# EAGLE design power (EAGLE 5.07)
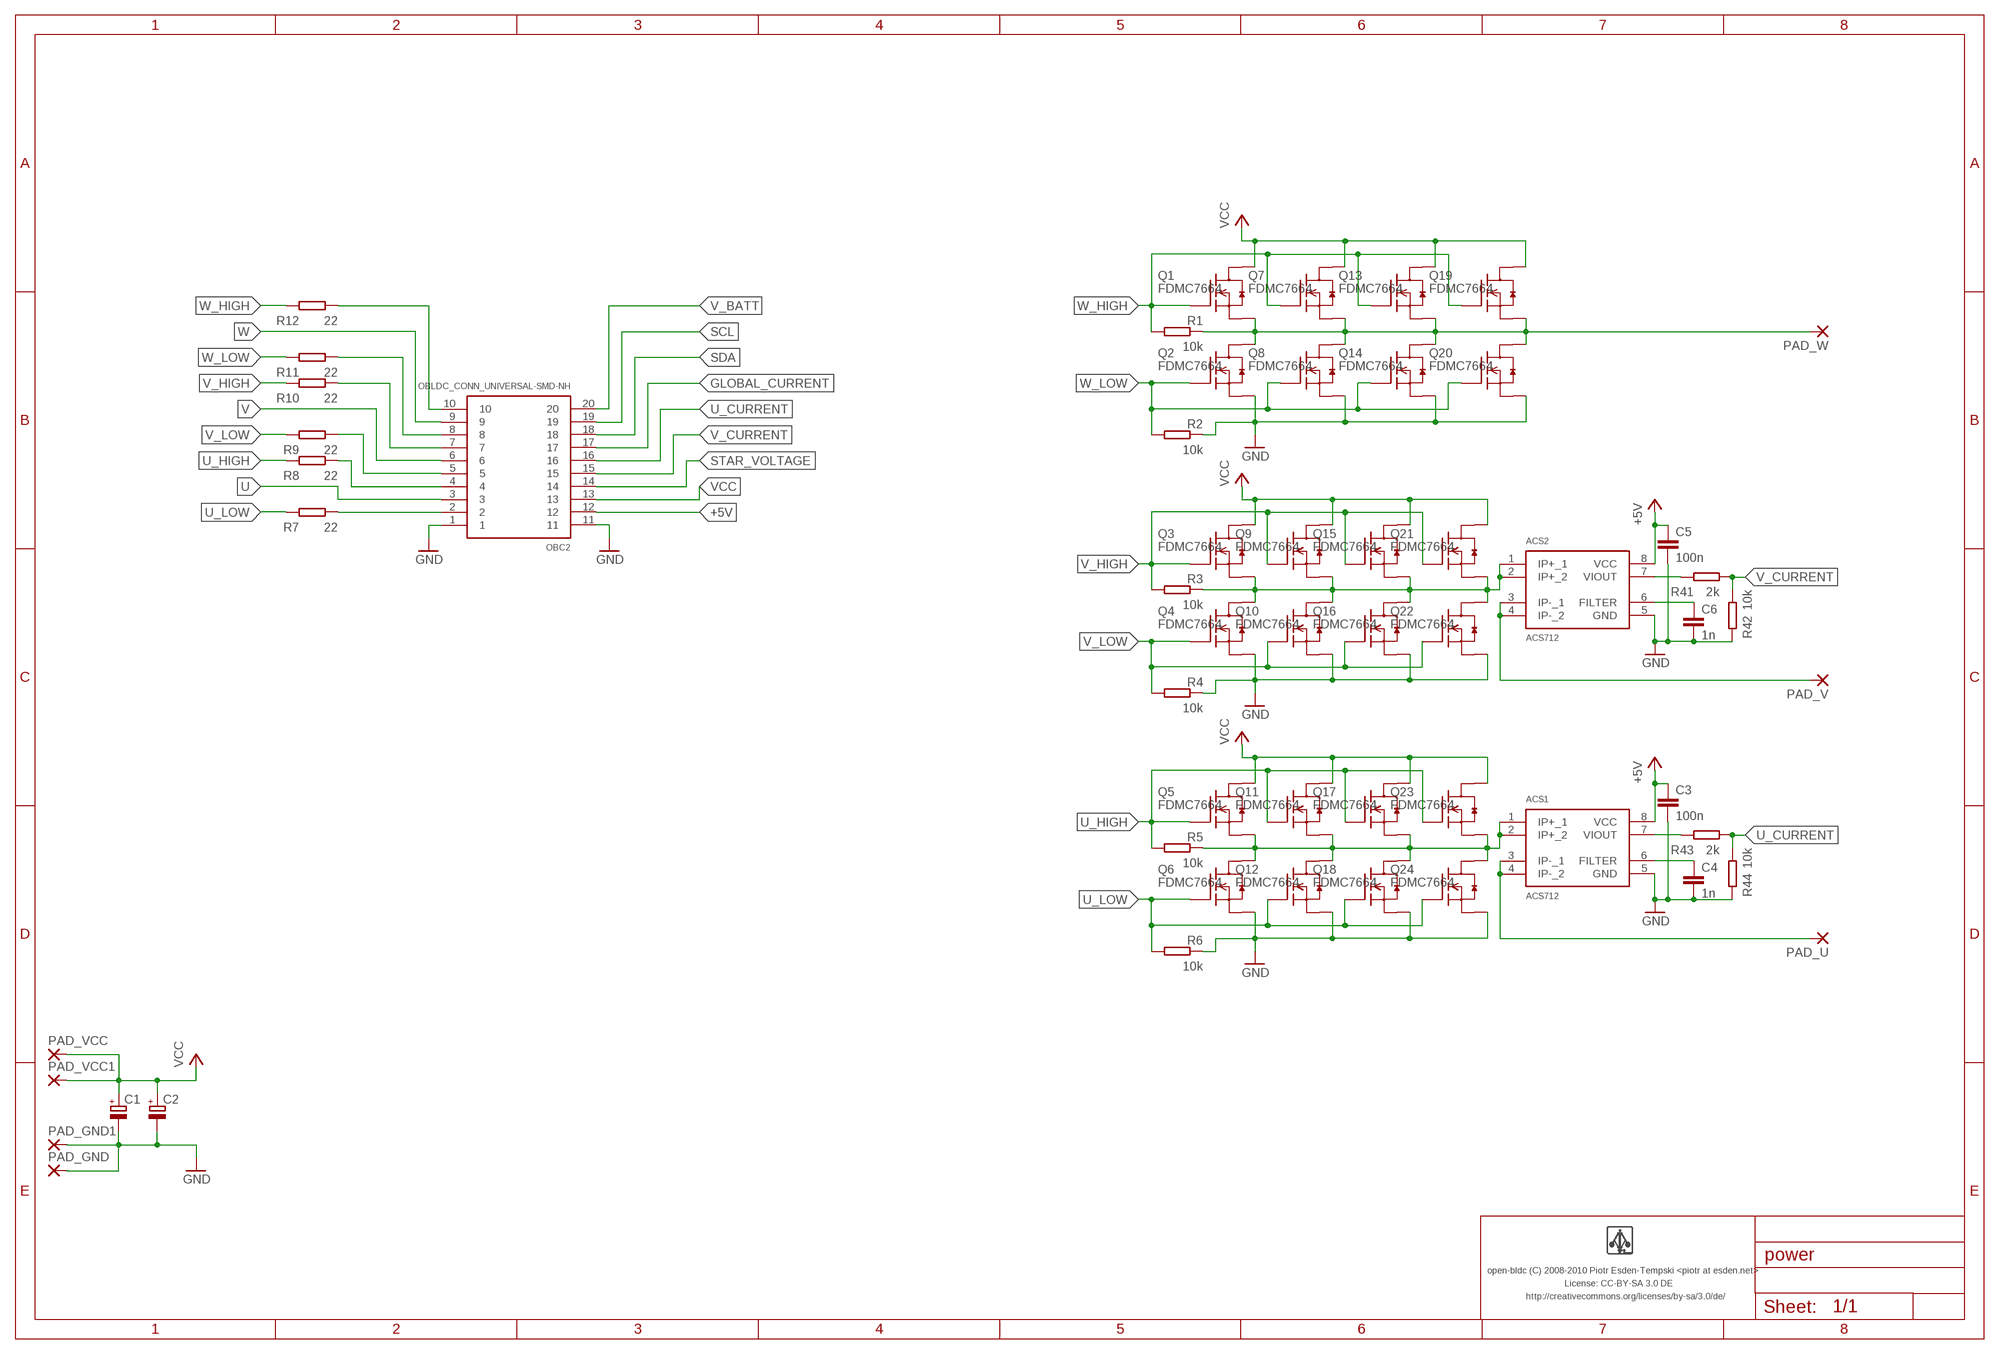
[diagram p0: schematic, sheet 1]

## Parts
ACS1  ACS712  [SO8]
ACS2  ACS712  [SO8]
C1  CPOL-EUE5-10.5  [E5-10,5]
C2  CPOL-EUE5-10.5  [E5-10,5]
C3  100n  CAPACITOR-0603  [0603-CAP]
C4  1n  CAPACITOR-0603  [0603-CAP]
C5  100n  CAPACITOR-0603  [0603-CAP]
C6  1n  CAPACITOR-0603  [0603-CAP]
OBC2  OBLDC_CONN_UNIVERSAL-SMD-NH  [OBLDC_CONN_SMD_NO_HOLES]
PAD_GND  WIREPAD-2MM  [WIREPAD_2MM]
PAD_GND1  WIREPAD-2MM  [WIREPAD_2MM]
PAD_U  WIREPAD-2MM  [WIREPAD_2MM]
PAD_V  WIREPAD-2MM  [WIREPAD_2MM]
PAD_VCC  WIREPAD-2MM  [WIREPAD_2MM]
PAD_VCC1  WIREPAD-2MM  [WIREPAD_2MM]
PAD_W  WIREPAD-2MM  [WIREPAD_2MM]
Q1  FDMC7664  [MLP33]
Q2  FDMC7664  [MLP33]
Q3  FDMC7664  [MLP33]
Q4  FDMC7664  [MLP33]
Q5  FDMC7664  [MLP33]
Q6  FDMC7664  [MLP33]
Q7  FDMC7664  [MLP33]
Q8  FDMC7664  [MLP33]
Q9  FDMC7664  [MLP33]
Q10  FDMC7664  [MLP33]
Q11  FDMC7664  [MLP33]
Q12  FDMC7664  [MLP33]
Q13  FDMC7664  [MLP33]
Q14  FDMC7664  [MLP33]
Q15  FDMC7664  [MLP33]
Q16  FDMC7664  [MLP33]
Q17  FDMC7664  [MLP33]
Q18  FDMC7664  [MLP33]
Q19  FDMC7664  [MLP33]
Q20  FDMC7664  [MLP33]
Q21  FDMC7664  [MLP33]
Q22  FDMC7664  [MLP33]
Q23  FDMC7664  [MLP33]
Q24  FDMC7664  [MLP33]
R1  10k  RESISTOR-0603  [0603-RES]
R2  10k  RESISTOR-0603  [0603-RES]
R3  10k  RESISTOR-0603  [0603-RES]
R4  10k  RESISTOR-0603  [0603-RES]
R5  10k  RESISTOR-0603  [0603-RES]
R6  10k  RESISTOR-0603  [0603-RES]
R7  22  RESISTOR-0603  [0603-RES]
R8  22  RESISTOR-0603  [0603-RES]
R9  22  RESISTOR-0603  [0603-RES]
R10  22  RESISTOR-0603  [0603-RES]
R11  22  RESISTOR-0603  [0603-RES]
R12  22  RESISTOR-0603  [0603-RES]
R41  2k  RESISTOR-0603  [0603-RES]
R42  10k  RESISTOR-0603  [0603-RES]
R43  2k  RESISTOR-0603  [0603-RES]
R44  10k  RESISTOR-0603  [0603-RES]
U$2  LOGO-NORM  [LOGO]

## Nets
+5V: ACS1.8(VCC) ACS2.8(VCC) C3.P$1 C5.P$1 OBC2.12
GLOBAL_CURRENT: OBC2.17
GND: ACS1.5(GND) ACS2.5(GND) C1.- C2.- C3.P$2 C4.P$2 C5.P$2 C6.P$2 OBC2.1 OBC2.11 PAD_GND1.1(P) PAD_GND.1(P) Q2.123S(S) Q4.123S(S) Q6.123S(S) Q8.123S(S) Q10.123S(S) Q12.123S(S) Q14.123S(S) Q16.123S(S) Q18.123S(S) Q20.123S(S) Q22.123S(S) Q24.123S(S) R2.P$1 R4.P$1 R6.P$1 R42.P$2 R44.P$2
N$1: ACS1.3(IP-_1) ACS1.4(IP-_2) PAD_U.1(P)
N$2: ACS2.6(FILTER) C6.P$1
N$3: ACS2.3(IP-_1) ACS2.4(IP-_2) PAD_V.1(P)
N$4: OBC2.2 R7.P$1
N$5: OBC2.4 R8.P$1
N$6: OBC2.5 R9.P$1
N$7: OBC2.7 R10.P$1
N$8: OBC2.8 R11.P$1
N$9: OBC2.10 R12.P$1
N$31: ACS1.6(FILTER) C4.P$1
N$32: ACS2.7(VIOUT) R41.P$2
N$35: ACS1.7(VIOUT) R43.P$2
SCL: OBC2.19
SDA: OBC2.18
STAR_VOLTAGE: OBC2.14
U: ACS1.1(IP+_1) ACS1.2(IP+_2) OBC2.3 Q5.123S(S) Q6.5678D(D) Q11.123S(S) Q12.5678D(D) Q17.123S(S) Q18.5678D(D) Q23.123S(S) Q24.5678D(D) R5.P$1
U_CURRENT: OBC2.16 R43.P$1 R44.P$1
U_HIGH: Q5.4G(G) Q11.4G(G) Q17.4G(G) Q23.4G(G) R5.P$2 R8.P$2
U_LOW: Q6.4G(G) Q12.4G(G) Q18.4G(G) Q24.4G(G) R6.P$2 R7.P$2
V: ACS2.1(IP+_1) ACS2.2(IP+_2) OBC2.6 Q3.123S(S) Q4.5678D(D) Q9.123S(S) Q10.5678D(D) Q15.123S(S) Q16.5678D(D) Q21.123S(S) Q22.5678D(D) R3.P$1
V_BATT: OBC2.20
V_CURRENT: OBC2.15 R41.P$1 R42.P$1
V_HIGH: Q3.4G(G) Q9.4G(G) Q15.4G(G) Q21.4G(G) R3.P$2 R10.P$2
V_LOW: Q4.4G(G) Q10.4G(G) Q16.4G(G) Q22.4G(G) R4.P$2 R9.P$2
VCC: C1.+ C2.+ OBC2.13 PAD_VCC1.1(P) PAD_VCC.1(P) Q1.5678D(D) Q3.5678D(D) Q5.5678D(D) Q7.5678D(D) Q9.5678D(D) Q11.5678D(D) Q13.5678D(D) Q15.5678D(D) Q17.5678D(D) Q19.5678D(D) Q21.5678D(D) Q23.5678D(D)
W: OBC2.9 PAD_W.1(P) Q1.123S(S) Q2.5678D(D) Q7.123S(S) Q8.5678D(D) Q13.123S(S) Q14.5678D(D) Q19.123S(S) Q20.5678D(D) R1.P$1
W_HIGH: Q1.4G(G) Q7.4G(G) Q13.4G(G) Q19.4G(G) R1.P$2 R12.P$2
W_LOW: Q2.4G(G) Q8.4G(G) Q14.4G(G) Q20.4G(G) R2.P$2 R11.P$2

## Notes on the sheet
- open-bldc (C) 2008-2010 Piotr Esden-Tempski <piotr at esden.net>
- License: CC-BY-SA 3.0 DE
- http://creativecommons.org/licenses/by-sa/3.0/de/

## Library data of the parts
ACS1 ACS2 = open-bldc:ACS712
C1 C2 = resistor:CPOL-EU: POLARIZED CAPACITOR, European symbol
C3-C6 = pel_dipol_comp:CAPACITOR
OBC2 = open-bldc:OBLDC_CONN_UNIVERSAL
PAD_GND PAD_GND1 PAD_U PAD_V PAD_VCC PAD_VCC1 PAD_W = open-bldc:WIREPAD: THROUGH-HOLE PAD
Q1-Q24 = open-bldc:FDMC7664
R1-R12 R41-R44 = pel_dipol_comp:RESISTOR
U$2 = open-bldc:LOGO

## Board
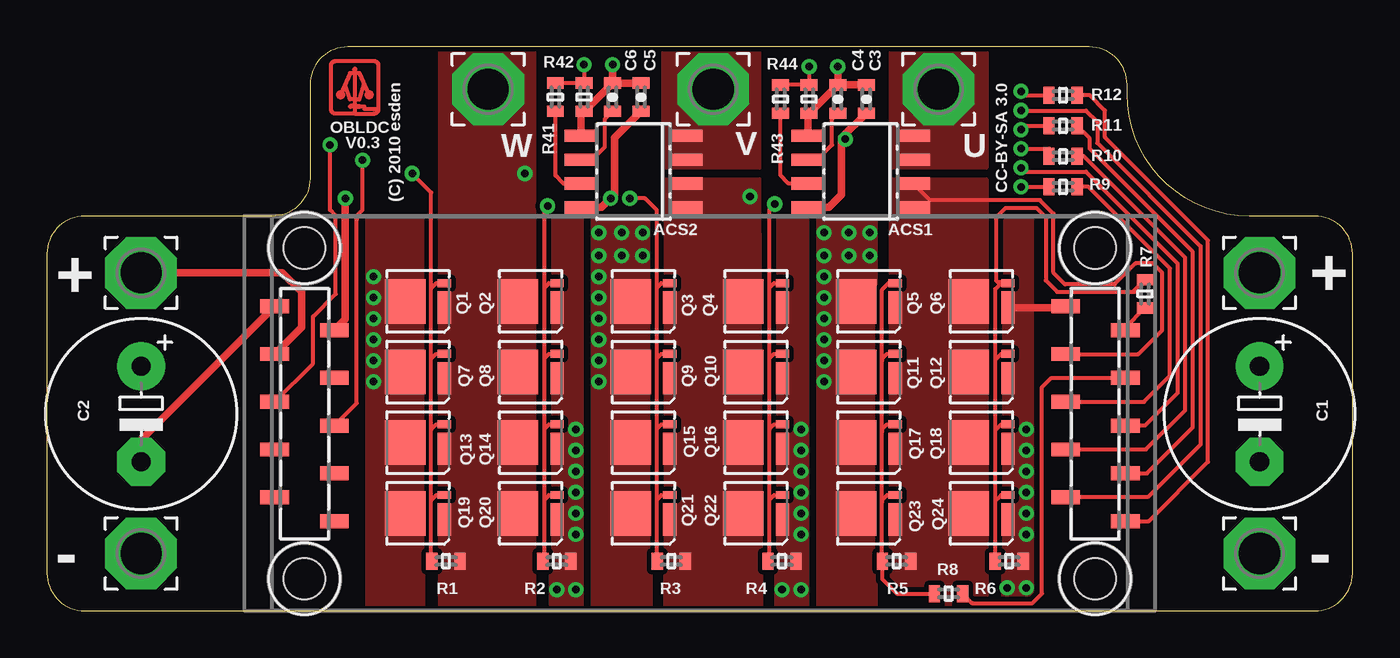
[diagram p1: board, top side]
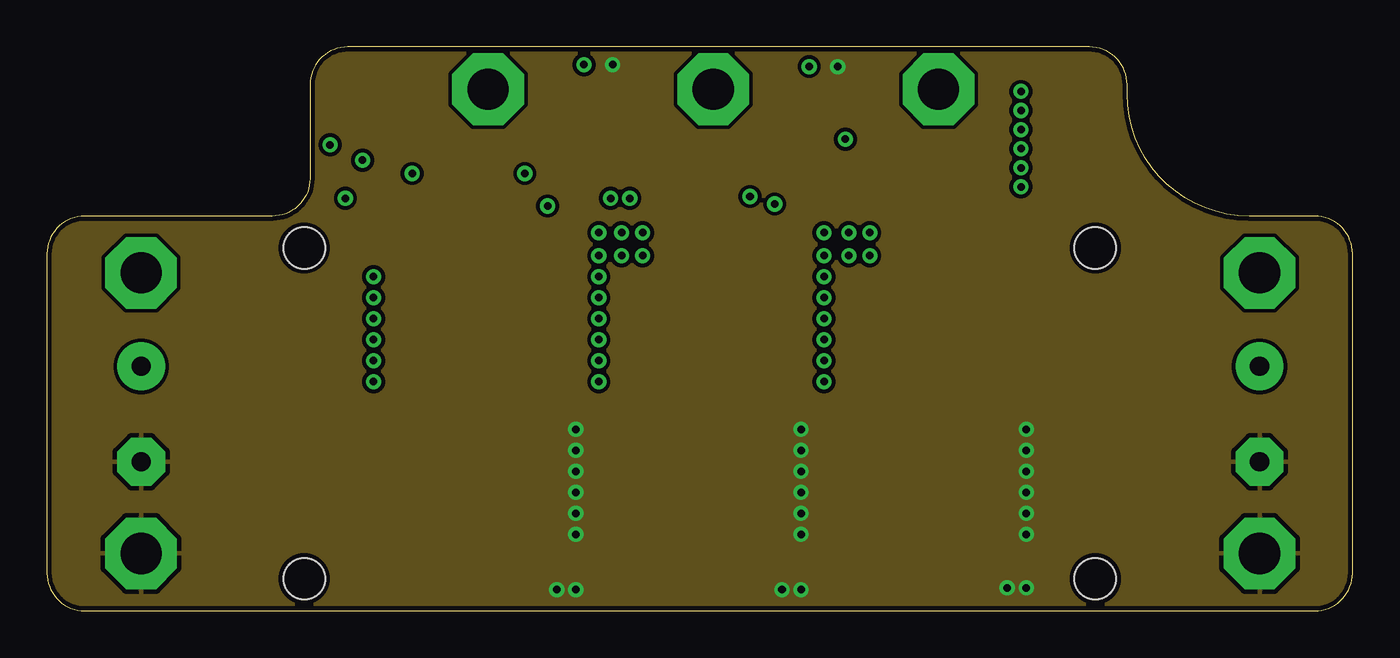
[diagram p2: board, inner layer Route2]
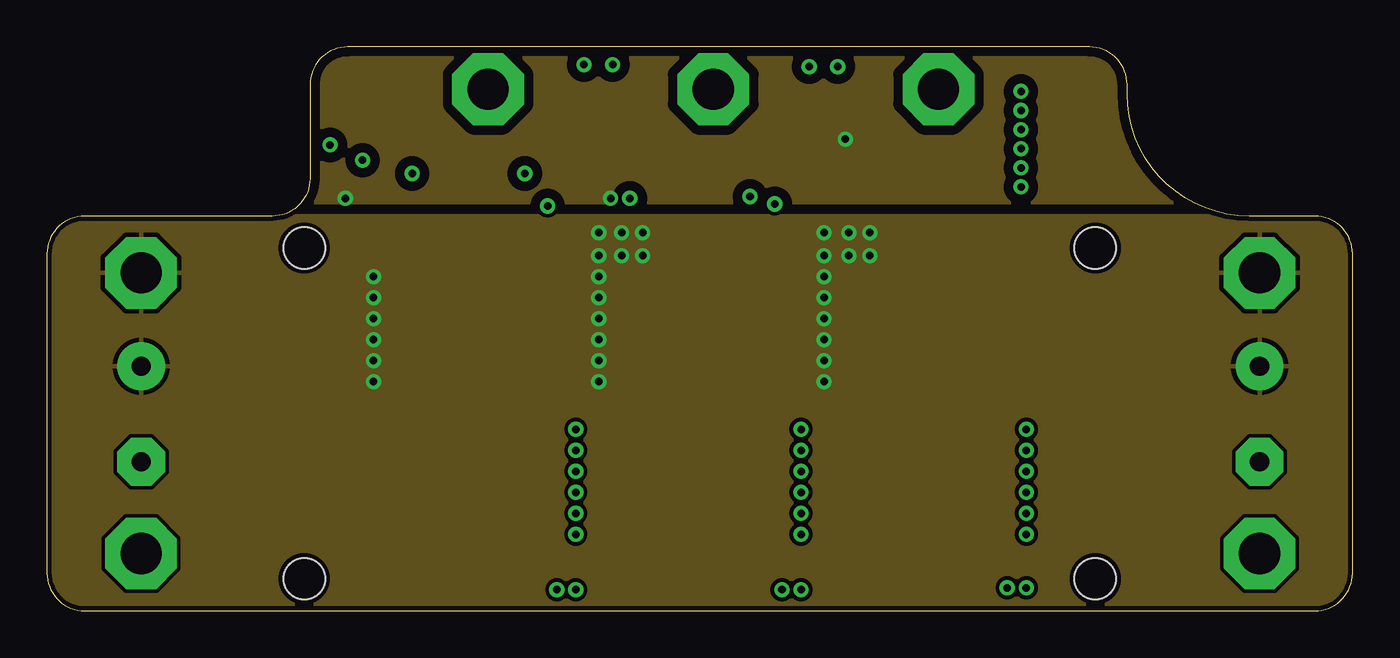
[diagram p3: board, inner layer Route15]
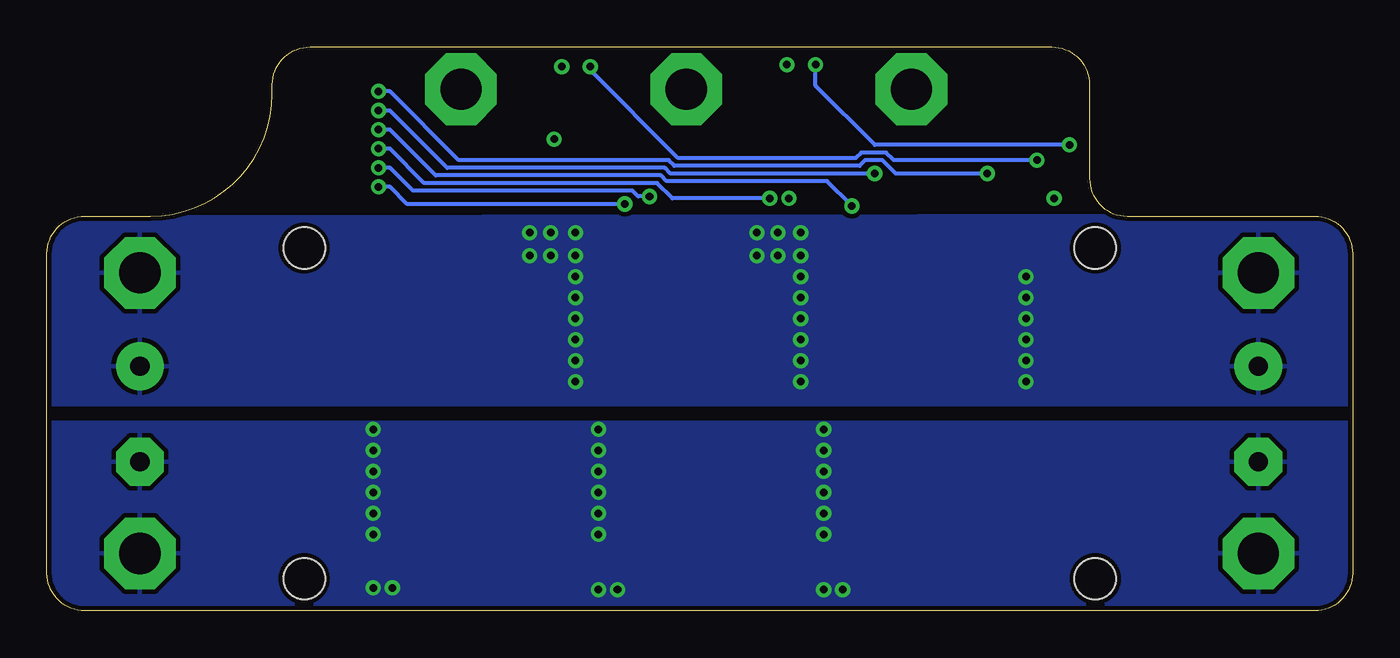
[diagram p4: board, bottom side, seen from below]

Size 69.5 x 30 mm. Coordinates in mm from the lower left corner, seen from the top.
Outline: 2,0 67.5,0 arc90 69.5,2 69.5,19 arc90 67.5,21 64,21 arc-90 57.5,27.5 57.5,28 arc90 55.5,30 16,30 arc90 14,28 14,23 arc-90 12,21 2,21 arc90 0,19 0,2 arc90 2,0
Copper layers (1*2+15*16): Top 0.035mm / dielectric 1.5mm / Route2 0.035mm / dielectric 0.15mm / Route15 0.035mm / dielectric 0.2mm / Bottom 0.035mm
Design rules "default *": minimum track width 8mil, minimum drill 0.4mm, track to track 8mil, track to pad 8mil, pad to pad 8mil, via to via 8mil, smd to smd 8mil, copper to edge 10mil, drill to drill 8mil, minimum pad ring 10mil, minimum via ring 8mil, stop-mask expansion 4mil, vias tented up to drill 0.4mm, thermal gap 10mil

### Footprints (pad centres in the part's own frame; a part is rotated, then mirrored left to right if it is on the bottom)
SO8 = smd 0.65 x 1.75: 1 -1.905,-2.8; 2 -0.635,-2.8; 3 0.635,-2.8; 4 1.905,-2.8; 5 1.905,2.8; 6 0.635,2.8; 7 -0.635,2.8; 8 -1.905,2.8
E5-10,5 = drill 1.016 pad 2.54 round: + -2.54,0 | drill 1.016 pad 2.54 octagon: - 2.54,0
0603-CAP = smd 0.6 x 0.9: P$1 -0.75,0; P$2 0.75,0
OBLDC_CONN_SMD_NO_HOLES = smd 1.525 x 0.74: 1 43.727,16.2; 2 46.903,14.93; 3 43.727,13.66; 4 46.903,12.39; 5 43.727,11.12; 6 46.903,9.85; 7 43.727,8.58; 8 46.903,7.31; 9 43.727,6.04; 10 46.903,4.77; 11 1.624,16.2; 12 4.799,14.93; 13 1.624,13.66; 14 4.799,12.39; 15 1.624,11.12; 16 4.799,9.85; 17 1.624,8.58; 18 4.799,7.31; 19 1.624,6.04; 20 4.799,4.77
WIREPAD_2MM = drill 2.2 pad 3.81 octagon: 1 0,0
MLP33 = smd 0.42 x 0.7: 4G 0.975,-1.4 | smd 1.72 x 0.7: 123S -0.325,-1.4 | smd 2.37 x 2.15: 5678D 0,0.675
0603-RES = smd 0.6 x 0.9: P$1 -0.75,0; P$2 0.75,0
OBLDC_MECH = hole 2.2: 1.7,1.7; 1.7,19.3; 43.8,1.7; 43.8,19.3

### Placement (x,y rotation side)
ACS1  43.32,23.37 90 top
ACS2  31.23,23.37 90 top
C1  64.55,10.46 270 top
C2  5.01,10.46 270 top
C3  43.62,27.23 90 top
C4  42.1,27.23 90 top
C5  31.63,27.33 90 top
C6  30.11,27.33 90 top
OBC2  10.5,0 0 top
PAD_GND  5.01,3.05 270 top
PAD_GND1  64.55,3.05 0 top
PAD_U  47.46,27.75 0 top
PAD_V  35.47,27.75 180 top
PAD_VCC  5.01,17.98 90 top
PAD_VCC1  64.55,17.98 0 top
PAD_W  23.48,27.75 90 top
Q1  19.75,16.46 90 top
Q2  25.75,16.46 90 top
Q3  31.75,16.46 90 top
Q4  37.75,16.46 90 top
Q5  43.75,16.46 90 top
Q6  49.75,16.46 90 top
Q7  19.75,12.7 90 top
Q8  25.75,12.7 90 top
Q9  31.75,12.7 90 top
Q10  37.75,12.7 90 top
Q11  43.75,12.7 90 top
Q12  49.75,12.7 90 top
Q13  19.75,8.94 90 top
Q14  25.75,8.94 90 top
Q15  31.75,8.94 90 top
Q16  37.75,8.94 90 top
Q17  43.75,8.94 90 top
Q18  49.75,8.94 90 top
Q19  19.75,5.18 90 top
Q20  25.75,5.18 90 top
Q21  31.75,5.18 90 top
Q22  37.75,5.18 90 top
Q23  43.75,5.18 90 top
Q24  49.75,5.18 90 top
R1  21.25,2.64 180 top
R2  27.14,2.64 180 top
R3  33.23,2.64 180 top
R4  39.13,2.64 180 top
R5  45.22,2.64 180 top
R6  51.22,2.64 180 top
R7  58.46,16.87 90 top
R8  47.99,0.91 180 top
R9  54.09,22.56 180 top
R10  54.09,24.18 180 top
R11  54.09,25.81 180 top
R12  54.09,27.43 180 top
R41  27.06,27.33 270 top
R42  28.58,27.33 270 top
R43  39.05,27.23 270 top
R44  40.57,27.23 270 top
U$1  [OBLDC_MECH]  12,0 0 top
U$2  16.37,27.74 0 top

### Tracks (layer width: path | path; a pad name or v marks a point on that pad's centre or on a via)
+5V  (via drill 0.4)
  Top 0.406: OBC2.12 15.88,15.52 v15.88,21.95 | ACS2.8 29.52,21.46 v30.01,21.95 30.21,22.15 30.21,25.09 30.21,25.16 C5.P$1 | ACS1.8 41.61,21.46 42.3,22.15 42.3,25.16 | 42.3,25.16 C3.P$1 | 42.3,25.16 42.36,25.09 v42.5,25.09
  pour Route15 (isolate 0.508, rank 2): 0,21 69.5,21 69.5,30 0,30
GND  (via drill 0.4)
  Top 0.406: OBC2.11 5.01,9.09 C2.- | OBC2.1 54.16,16.13 Q6.123S | C6.P$2 v30.11,29.06 | C6.P$2 C5.P$2 | C6.P$2 28.61,26.58 R42.P$2 28.43,26.42 ACS2.5 | C4.P$2 v42.1,28.96 | C4.P$2 C3.P$2 | C4.P$2 40.6,26.48 R44.P$2 40.52,26.42 ACS1.5
  other vias: 28.15,4.06 28.15,5.18 28.15,6.3 28.15,7.42 28.15,8.53 28.15,9.65 40.14,4.06 40.14,5.18 40.14,6.3 40.14,7.42 40.14,8.53 40.14,9.65 52.13,4.06 52.13,5.18 52.13,6.3 52.13,7.42 52.13,8.53 52.13,9.65 52.13,1.22 51.12,1.22 40.14,1.12 39.13,1.12 28.15,1.12 27.14,1.12
  pour Top (isolate 0.254, no thermals): 26.83,21 28.46,21 28.46,0 26.83,0
  pour Top (isolate 0.254, no thermals): 38.82,21 40.45,21 40.45,0 38.82,0
  pour Top (isolate 0.254, rank 6, no thermals): 50.91,21 52.44,21 52.44,0 50.91,0
  pour Bottom (isolate 0.254): 0,10 69.5,10 69.5,0 0,0
  pour Route2: 0,0 69.5,0 69.5,30 0,30
N$1
  pour Top (rank 2, no thermals): 44.92,30 50,30 50,23.57 44.92,23.57
N$2
  Top 0.203: C6.P$1 29.7,26.17 29.7,24.69 29.02,24 ACS2.6
N$3
  pour Top (rank 2, no thermals): 32.83,30 37.91,30 37.91,23.57 32.83,23.57
N$4
  Top 0.203: OBC2.2 57.4,15.06 R7.P$1
N$5
  Top 0.203: OBC2.4 53.47,12.39 52.97,11.89 52.97,0.91 52.46,0.41 49.25,0.41 R8.P$1
N$6
  Top 0.203: OBC2.5 58.4,11.12 59.78,12.5 59.78,18.23 55.45,22.55 R9.P$1
N$7
  Top 0.203: OBC2.7 58.5,8.58 60.59,10.67 60.59,18.8 55.2,24.18 R10.P$1
N$8
  Top 0.203: OBC2.8 58.55,7.31 60.99,9.75 60.99,19.1 55.51,24.59 55.51,25.13 R11.P$1
N$9
  Top 0.203: OBC2.10 58.65,4.77 61.81,7.92 61.81,19.71 56.32,25.2 56.32,26.62 55.51,27.43 R12.P$1
N$31
  Top 0.203: C4.P$1 41.79,26.17 41.79,24.79 41,24 ACS1.6
N$32
  Top 0.203: R41.P$2 27.06,23.16 27.49,22.73 ACS2.7
N$35
  Top 0.203: R43.P$2 39.05,23.16 39.48,22.73 ACS1.7
U
  Top 0.203: ACS1.2 47.01,21.84 52.87,21.84 53.58,21.13 53.58,17.98 54.19,17.37 56.83,17.37 57.95,18.49 58.86,18.49 59.37,17.98 59.37,14.94 58.09,13.66 OBC2.3
  pour Top (isolate 0.254, no thermals): 44.92,22.96 50,22.96 50,0 44.92,0
U_CURRENT  (via drill 0.4)
  Top 0.203: OBC2.16 16.49,11.04 16.49,20.83 16.49,21.03 16.8,21.34 v16.8,23.98 | v40.57,28.96 R44.P$1 R43.P$1
  Bottom 0.203: v16.8,23.98 24.42,23.98 24.83,24.38 26.15,24.38 26.45,24.08 35.9,24.08 40.57,28.75 v40.57,28.96
U_HIGH
  Top 0.203: Q5.4G 44.8,17.43 44.46,17.09 44.46,13.41 | 44.46,5.89 44.46,5.79 44.46,2.65 R5.P$2 44.47,1.69 45.25,0.91 R8.P$2 | 44.46,5.89 44.46,9.55 44.46,9.65 | 44.46,9.65 44.46,13.31 44.46,13.41 | Q17.4G 44.72,9.92 44.46,9.65 | Q23.4G 44.72,6.16 44.46,5.89 | Q11.4G 44.72,13.68 44.46,13.41
U_LOW
  Top 0.203: 57.81,16.97 53.78,16.97 53.17,17.58 53.17,20.93 52.66,21.44 51.04,21.44 50.53,20.93 50.53,17.58 50.63,17.48 51.11,17.48 Q6.4G 50.79,17.43 50.48,17.12 50.48,13.36 | 57.81,16.97 57.91,16.97 57.81,16.97 | 50.48,5.84 50.48,9.6 | 50.48,9.6 50.48,13.36 | Q12.4G 50.79,13.68 50.48,13.36 | Q18.4G 50.79,9.92 50.48,9.6 | Q24.4G 50.79,6.16 50.48,5.84 | 50.48,5.84 50.48,2.65 R6.P$2 | 57.81,16.97 R7.P$2
V  (via drill 0.4)
  Top 0.203: OBC2.6 58.45,9.85 60.18,11.58 60.18,18.49 55.31,23.37 52.05,23.37 v51.85,23.57
  Bottom 0.203: v37.42,22.05 38.03,22.05 38.34,22.35 50.02,22.35 51.24,23.57 v51.85,23.57
  pour Top (isolate 0.254, no thermals): 32.83,22.96 37.91,22.96 38.01,0 32.93,0
V_CURRENT  (via drill 0.4)
  Top 0.203: OBC2.15 14.16,13.15 14.16,15.65 15.38,16.87 15.38,21.03 15.07,21.34 v15.07,24.79 | R41.P$1 R42.P$1 v28.59,29.06
  Bottom 0.203: v15.07,24.79 25.44,24.79 28.59,27.94 v28.59,29.06
V_HIGH  (via drill 0.4)
  Top 0.203: Q3.4G 32.71,17.43 32.47,17.2 | 32.47,5.92 32.47,9.68 | 32.47,9.68 32.47,13.44 | 32.47,13.44 32.47,17.2 | Q9.4G 32.71,13.68 32.47,13.44 | Q15.4G 32.71,9.92 32.47,9.68 | Q21.4G 32.71,6.16 32.47,5.92 | 32.47,5.92 32.47,2.65 R3.P$2 | v31.02,21.95 31.84,21.95 32.47,21.31 32.47,17.2 | v51.85,24.59 53.34,24.59 R10.P$2
  Bottom 0.203: v31.02,21.95 36.2,21.95 37.02,22.76 49.41,22.76 51.24,24.59 v51.85,24.59
V_LOW  (via drill 0.4)
  Top 0.203: Q4.4G 38.7,17.43 38.47,17.2 | 38.47,5.92 38.47,2.73 R4.P$2 | 38.47,5.92 38.47,9.68 | 38.47,9.68 38.47,13.44 | 38.47,13.44 38.47,17.2 | Q10.4G 38.7,13.68 38.47,13.44 | Q16.4G 38.7,9.92 38.47,9.68 | Q22.4G 38.7,6.16 38.47,5.92 | v38.75,21.64 38.47,21.36 38.47,17.2 | v51.85,22.55 R9.P$2
  Bottom 0.203: v38.75,21.64 50.33,21.64 51.24,22.55 v51.85,22.55
VCC  (via drill 0.4)
  Top 0.406: OBC2.13 13.55,15.08 13.55,16.97 12.53,17.98 PAD_VCC.1
  other vias: 41.36,17.78 41.36,16.66 41.36,15.54 41.36,14.43 41.36,13.31 41.36,12.19 29.37,17.78 29.37,16.66 29.37,15.54 29.37,14.43 29.37,13.31 29.37,12.19 17.38,17.78 17.38,16.66 17.38,15.54 17.38,14.43 17.38,13.31 17.38,12.19 29.37,18.9 29.37,20.12 31.71,18.9 31.71,20.12 30.59,20.12 30.59,18.9 41.36,18.9 43.8,18.9 42.68,18.9 41.36,20.12 42.68,20.12 43.8,20.12
  pour Top (isolate 0.254, rank 6, no thermals): 17.08,21 20.03,21 20.03,0 17.08,0
  pour Top (isolate 0.254, no thermals): 29.07,21 32.12,21 32.12,0 29.07,0
  pour Top (isolate 0.254, no thermals): 41.06,21 44.11,21 44.11,0 41.06,0
  pour Bottom (isolate 0.254): 0,21.03 69.5,20.93 69.5,11 0,11
  pour Route15: 0,0 69.5,0 69.5,21 0,21
W  (via drill 0.4)
  Top 0.203: OBC2.9 58.6,6.04 61.4,8.84 61.4,19.41 55.91,24.89 55.91,26.01 55.31,26.62 v51.85,26.62
  Bottom 0.203: v25.44,23.27 36.31,23.27 36.61,23.57 48.19,23.57 51.24,26.62 v51.85,26.62
  pour Top (isolate 0.254, no thermals): 20.94,30 25.92,30 25.92,0 20.94,0
W_HIGH  (via drill 0.4)
  Top 0.203: Q1.4G 20.72,17.43 20.46,17.17 | 20.46,5.89 20.46,2.68 R1.P$2 | 20.46,5.89 20.46,9.65 | 20.46,9.65 20.46,13.41 | 20.46,13.41 20.46,17.17 | Q7.4G 20.72,13.68 20.46,13.41 | Q13.4G 20.72,9.92 20.46,9.65 | Q19.4G 20.72,6.16 20.46,5.89 | v19.44,23.27 20.46,22.25 20.46,17.17 | R12.P$2 52.05,27.43 v51.85,27.64
  Bottom 0.203: v19.44,23.27 24.32,23.27 25.03,23.98 25.94,23.98 26.25,23.67 36.1,23.67 36.41,23.98 47.58,23.98 51.24,27.64 v51.85,27.64
W_LOW  (via drill 0.4)
  Top 0.203: Q2.4G 26.71,17.43 26.48,17.2 | 26.48,5.92 26.48,2.73 R2.P$2 | 26.48,5.92 26.48,9.68 | 26.48,9.68 26.48,13.44 | 26.48,13.44 26.48,17.2 | Q8.4G 26.71,13.68 26.48,13.44 | Q14.4G 26.71,9.92 26.48,9.68 | Q20.4G 26.71,6.16 26.48,5.92 | v26.65,21.54 26.48,21.36 26.48,17.2 | R11.P$2 52.05,25.81 v51.85,25.6
  Bottom 0.203: v26.65,21.54 27.98,22.86 28.89,22.86 36.51,22.86 36.81,23.16 48.8,23.16 51.24,25.6 v51.85,25.6

### Text on the board
tPlace: V | OBLDC | V0.3 | W | U | (C) 2010 esden | CC-BY-SA 3.0 | + | + | - | -